# EasyEDA schematic SCH_LM2596-5V-Buck-Converter-SMD_2024-10-14.json
TITLE: LM2596S 5V Buck Converter; REV: 1.0; Date: 2019-12-17; Sheet: 1/1; Drawn By: Nikola Pantelin; Company: PantelinEngineering
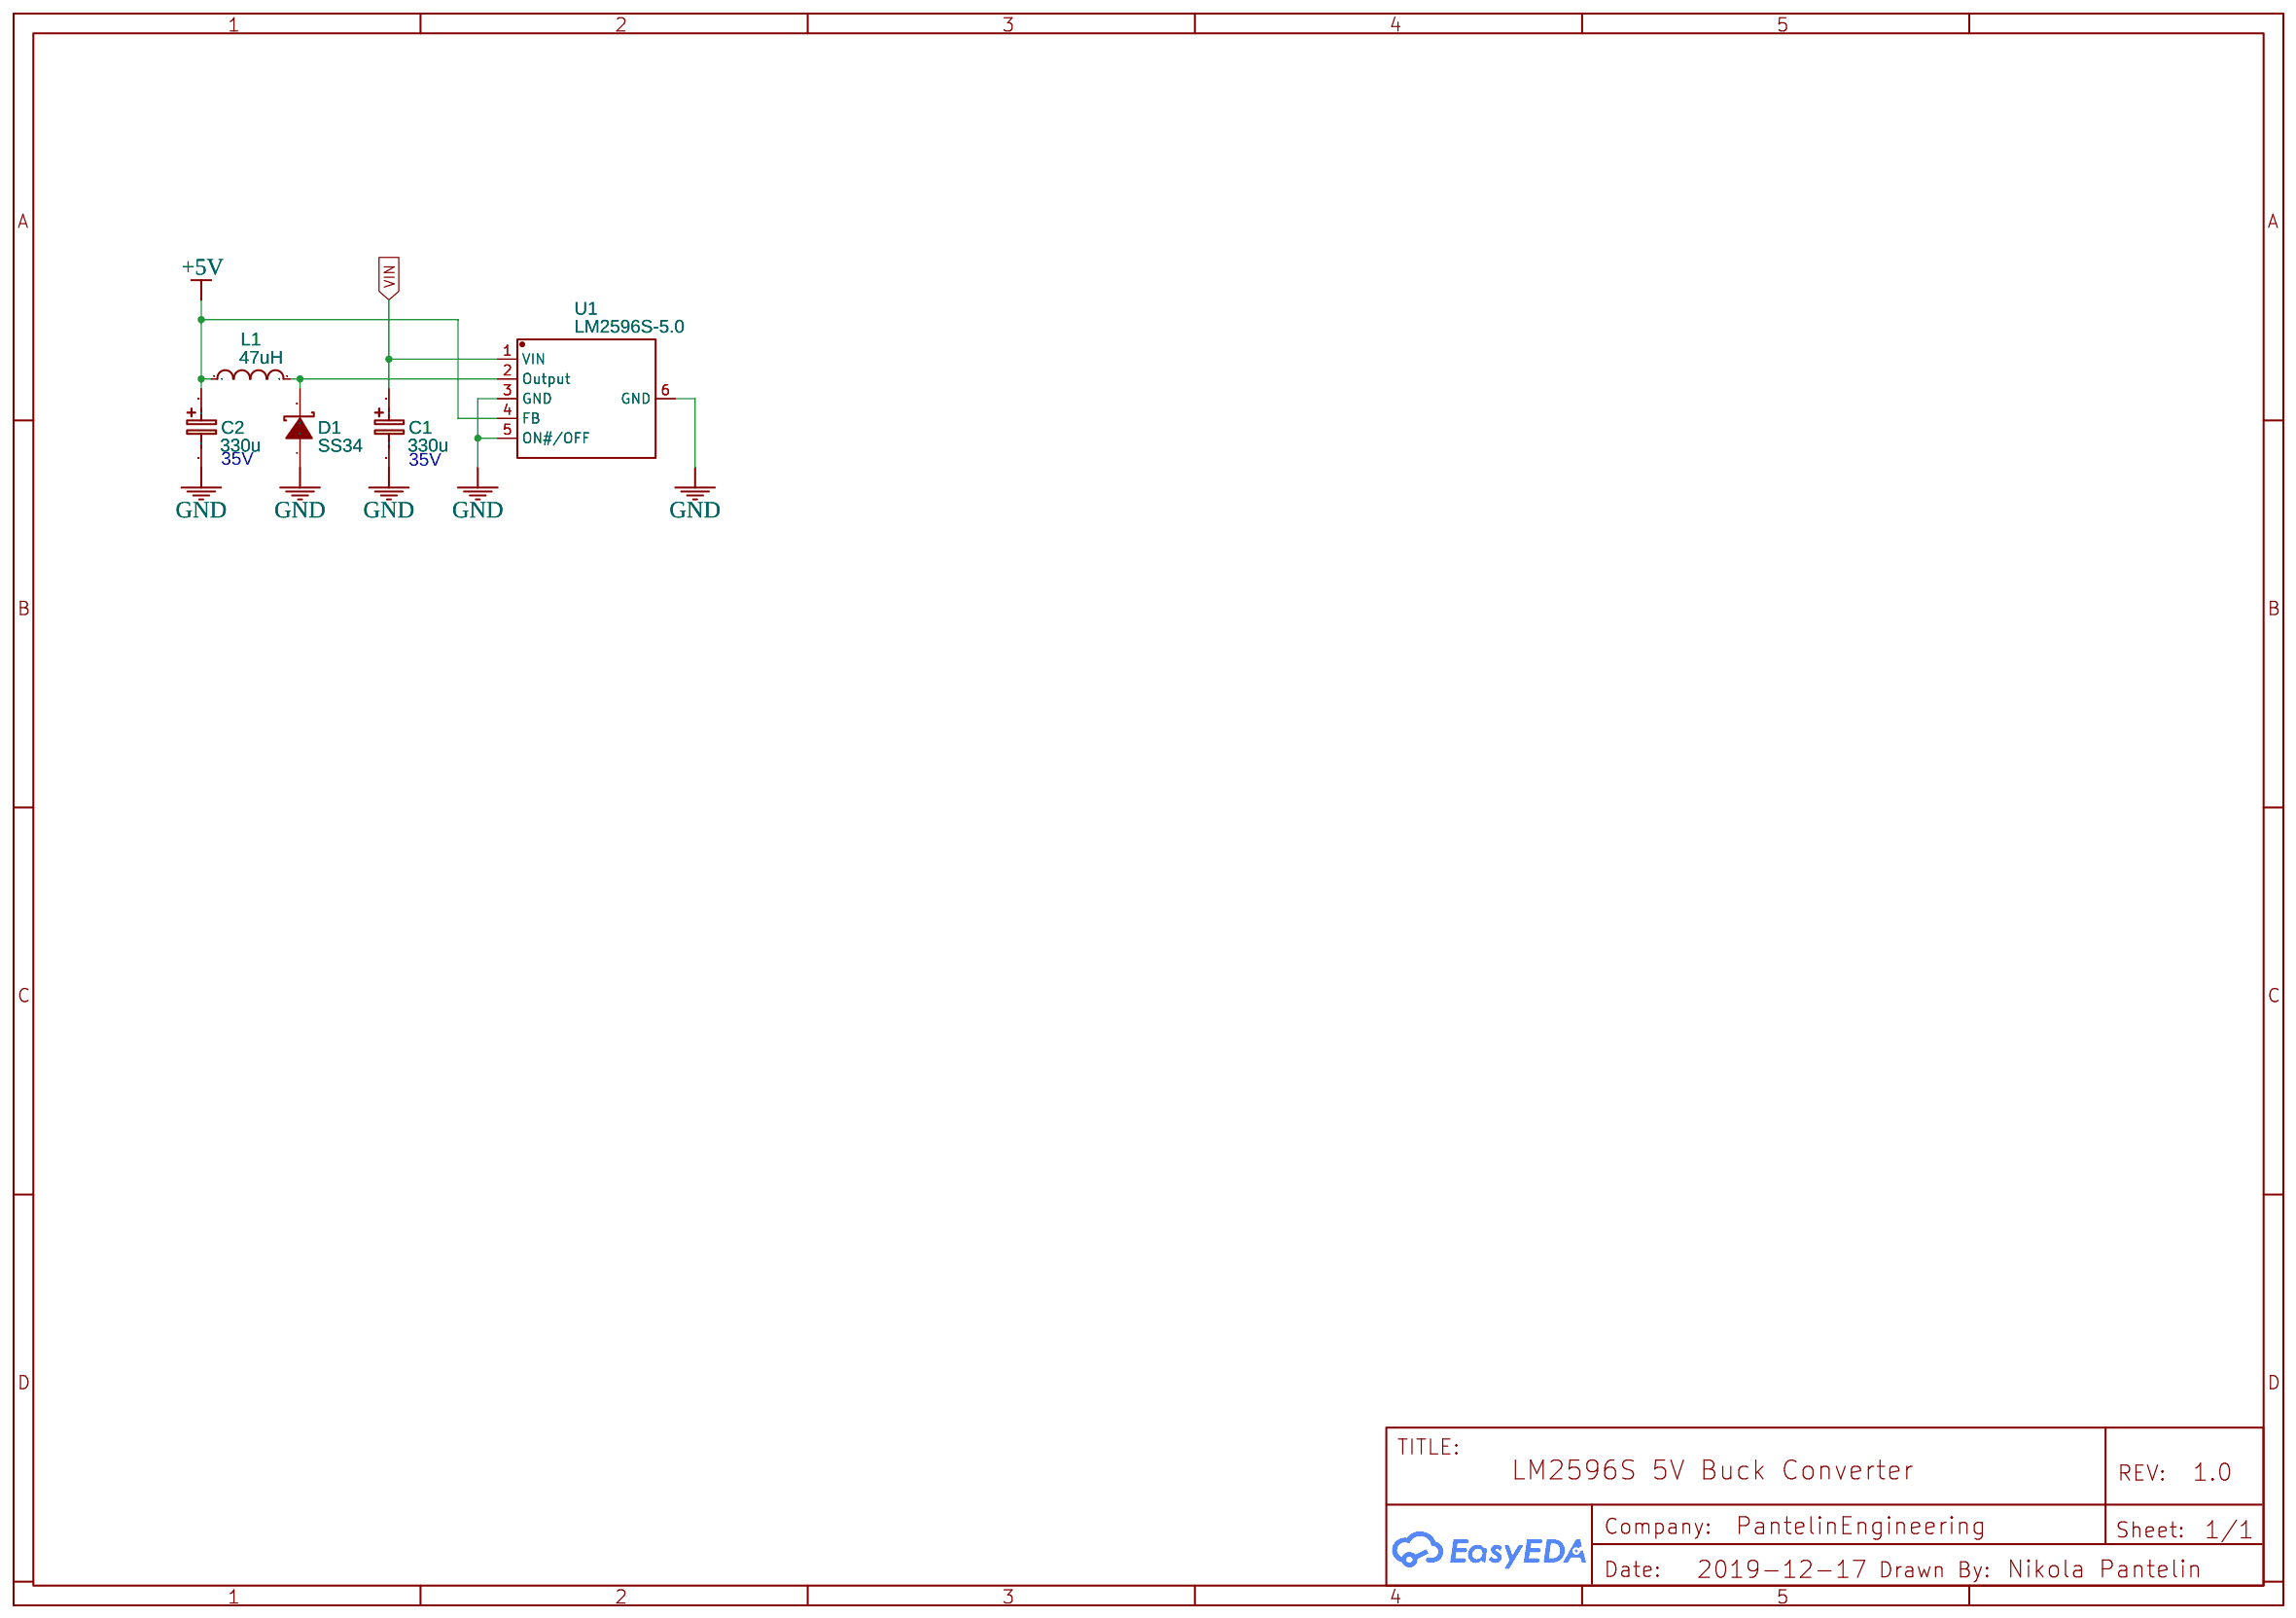
[diagram p0: schematic sheet]

## Parts
C1  330u  [CAP-D8.0XH10.5]
C2  330u  [CAP-D8.0XH10.5]
D1  SS34  [SMA(DO-214AC)]
L1  47uH  [IND-SMD_L12.0-W12.0_CDRH127NP]
U1  LM2596S-5.0  [TO-263-5_L10.6-W9.6-P1.70-LS15.9-BR]

## Library data of the parts
C1 C2 = Cap_Electrolytic(SMD)_D8.0XH10.5_EU: Contributor: EasyEDA; Manufacturer Part: ?
D1 = -: Supplier: LCSC; Manufacturer: Yenji; Contributor: LCSC; Supplier Part: C142458; LCSC Assembly: Yes; SMT Type: Extend
L1 = CDRH127NP-470MC: Supplier: LCSC; Manufacturer: Sumida; Contributor: LCSC; Supplier Part: C167265
U1 = -: Supplier: LCSC; Supplier Part: C116713; Manufacturer: Texas Instruments; Manufacturer Part: LM2596S-5.0/NOPB; Contributor: LCSC

## Nets
+5V: C2.1 L1.1 U1.4(FB)
GND: C1.2 C2.2 D1.1(A) U1.3(GND) U1.5(ON#/OFF) U1.6(GND)
VIN: C1.1 U1.1(VIN)
Net-(D1-2): D1.2(K) L1.2 U1.2(Output)

## Notes on the sheet
- 35V
- 35V
